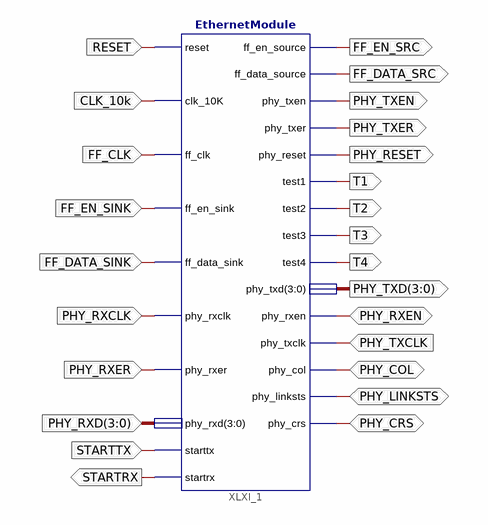
[diagram p0: schematic sheet 1]
// Xilinx ISE schematic eth_top_mod.sch (spartan6) as structural Verilog: 1 symbols, 25 ports
module eth_top_mod (
  input  RESET,
  input  CLK_10k,
  input  FF_CLK,
  input  FF_EN_SINK,
  input  FF_DATA_SINK,
  input  PHY_RXCLK,
  input  PHY_RXER,
  input  [3:0] PHY_RXD,
  input  PHY_TXCLK,
  input  STARTTX,
  inout  PHY_CRS,
  inout  PHY_LINKSTS,
  inout  PHY_COL,
  inout  PHY_RXEN,
  output [3:0] PHY_TXD,
  output T4,
  output T3,
  output T2,
  output T1,
  output PHY_RESET,
  output PHY_TXER,
  output PHY_TXEN,
  output FF_DATA_SRC,
  output FF_EN_SRC,
  output STARTRX
);

  EthernetModule XLXI_1 (
    .reset(RESET), .clk_10K(CLK_10k), .ff_clk(FF_CLK), .ff_en_sink(FF_EN_SINK), .ff_data_sink(FF_DATA_SINK),
    .phy_rxclk(PHY_RXCLK), .phy_rxer(PHY_RXER), .starttx(STARTTX), .phy_rxd(PHY_RXD), .phy_rxen(PHY_RXEN),
    .phy_txclk(PHY_TXCLK), .phy_col(PHY_COL), .phy_linksts(PHY_LINKSTS), .phy_crs(PHY_CRS),
    .ff_en_source(FF_EN_SRC), .ff_data_source(FF_DATA_SRC), .phy_txen(PHY_TXEN), .phy_txer(PHY_TXER),
    .phy_reset(PHY_RESET), .test1(T1), .test2(T2), .test3(T3), .test4(T4), .startrx(STARTRX),
    .phy_txd(PHY_TXD));
endmodule
